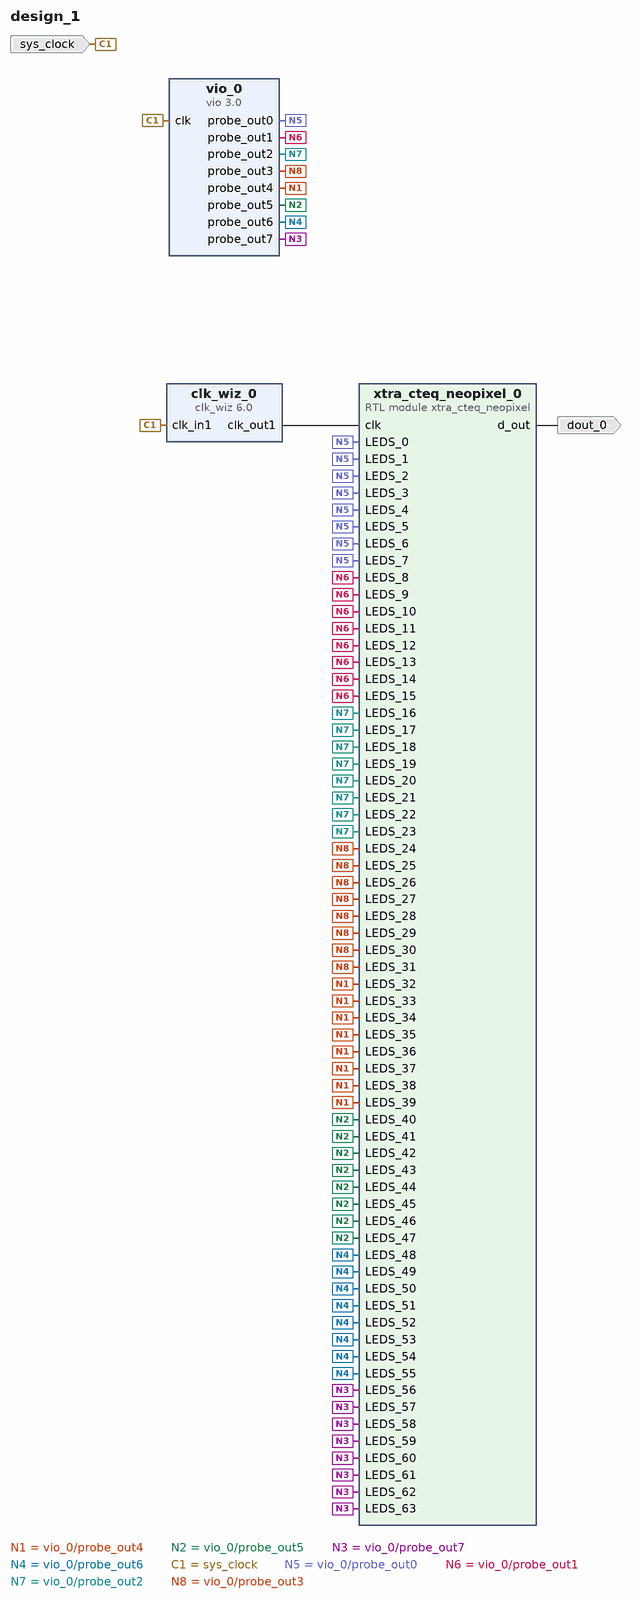
[diagram p0: block diagram of the top level]
# Vivado block design design_1, xc7z020clg400-1, Vivado 2021.2
create_bd_design design_1

create_bd_port -dir I -type clk sys_clock
set_property -dict {CONFIG.FREQ_HZ 125000000 CONFIG.PHASE 0.0} [get_bd_ports sys_clock]
create_bd_port -dir O dout_0

create_bd_cell -type ip -vlnv xilinx.com:ip:clk_wiz:6.0 clk_wiz_0
set_property -dict [list \
  CONFIG.CLKOUT1_JITTER 143.688 \
  CONFIG.CLKOUT1_PHASE_ERROR 96.948 \
  CONFIG.CLKOUT1_REQUESTED_OUT_FREQ 50 \
  CONFIG.CLKOUT1_USED true \
  CONFIG.CLK_IN1_BOARD_INTERFACE sys_clock \
  CONFIG.MMCM_CLKFBOUT_MULT_F 8.000 \
  CONFIG.MMCM_CLKOUT0_DIVIDE_F 20.000 \
  CONFIG.MMCM_DIVCLK_DIVIDE 1 \
  CONFIG.USE_BOARD_FLOW true \
  CONFIG.USE_LOCKED false \
  CONFIG.USE_RESET false \
] [get_bd_cells clk_wiz_0]
create_bd_cell -type module -reference xtra_cteq_neopixel xtra_cteq_neopixel_0
create_bd_cell -type ip -vlnv xilinx.com:ip:vio:3.0 vio_0
set_property -dict [list \
  CONFIG.C_NUM_PROBE_IN 0 \
  CONFIG.C_NUM_PROBE_OUT 8 \
  CONFIG.C_PROBE_OUT0_INIT_VAL 0x00FF00 \
  CONFIG.C_PROBE_OUT0_WIDTH 24 \
  CONFIG.C_PROBE_OUT1_INIT_VAL 0x00FF00 \
  CONFIG.C_PROBE_OUT1_WIDTH 24 \
  CONFIG.C_PROBE_OUT2_INIT_VAL 0x00FF00 \
  CONFIG.C_PROBE_OUT2_WIDTH 24 \
  CONFIG.C_PROBE_OUT3_INIT_VAL 0x0000FF \
  CONFIG.C_PROBE_OUT3_WIDTH 24 \
  CONFIG.C_PROBE_OUT4_INIT_VAL 0x0000FF \
  CONFIG.C_PROBE_OUT4_WIDTH 24 \
  CONFIG.C_PROBE_OUT5_INIT_VAL 0x0000FF \
  CONFIG.C_PROBE_OUT5_WIDTH 24 \
  CONFIG.C_PROBE_OUT6_INIT_VAL 0x0FF000 \
  CONFIG.C_PROBE_OUT6_WIDTH 24 \
  CONFIG.C_PROBE_OUT7_INIT_VAL 0x0FF000 \
  CONFIG.C_PROBE_OUT7_WIDTH 24 \
] [get_bd_cells vio_0]

# ---- connections ----

connect_bd_net [get_bd_pins vio_0/probe_out4] \
  [get_bd_pins xtra_cteq_neopixel_0/LEDS_32] [get_bd_pins xtra_cteq_neopixel_0/LEDS_33] \
  [get_bd_pins xtra_cteq_neopixel_0/LEDS_34] [get_bd_pins xtra_cteq_neopixel_0/LEDS_35] \
  [get_bd_pins xtra_cteq_neopixel_0/LEDS_36] [get_bd_pins xtra_cteq_neopixel_0/LEDS_37] \
  [get_bd_pins xtra_cteq_neopixel_0/LEDS_38] [get_bd_pins xtra_cteq_neopixel_0/LEDS_39]
connect_bd_net [get_bd_pins vio_0/probe_out5] \
  [get_bd_pins xtra_cteq_neopixel_0/LEDS_40] [get_bd_pins xtra_cteq_neopixel_0/LEDS_41] \
  [get_bd_pins xtra_cteq_neopixel_0/LEDS_42] [get_bd_pins xtra_cteq_neopixel_0/LEDS_43] \
  [get_bd_pins xtra_cteq_neopixel_0/LEDS_44] [get_bd_pins xtra_cteq_neopixel_0/LEDS_45] \
  [get_bd_pins xtra_cteq_neopixel_0/LEDS_46] [get_bd_pins xtra_cteq_neopixel_0/LEDS_47]
connect_bd_net [get_bd_pins vio_0/probe_out7] \
  [get_bd_pins xtra_cteq_neopixel_0/LEDS_63] [get_bd_pins xtra_cteq_neopixel_0/LEDS_62] \
  [get_bd_pins xtra_cteq_neopixel_0/LEDS_61] [get_bd_pins xtra_cteq_neopixel_0/LEDS_60] \
  [get_bd_pins xtra_cteq_neopixel_0/LEDS_59] [get_bd_pins xtra_cteq_neopixel_0/LEDS_58] \
  [get_bd_pins xtra_cteq_neopixel_0/LEDS_57] [get_bd_pins xtra_cteq_neopixel_0/LEDS_56]
connect_bd_net [get_bd_pins vio_0/probe_out6] \
  [get_bd_pins xtra_cteq_neopixel_0/LEDS_48] [get_bd_pins xtra_cteq_neopixel_0/LEDS_49] \
  [get_bd_pins xtra_cteq_neopixel_0/LEDS_50] [get_bd_pins xtra_cteq_neopixel_0/LEDS_51] \
  [get_bd_pins xtra_cteq_neopixel_0/LEDS_52] [get_bd_pins xtra_cteq_neopixel_0/LEDS_53] \
  [get_bd_pins xtra_cteq_neopixel_0/LEDS_54] [get_bd_pins xtra_cteq_neopixel_0/LEDS_55]
connect_bd_net [get_bd_pins clk_wiz_0/clk_out1] [get_bd_pins xtra_cteq_neopixel_0/clk]
connect_bd_net [get_bd_ports sys_clock] [get_bd_pins clk_wiz_0/clk_in1] [get_bd_pins vio_0/clk]
connect_bd_net [get_bd_pins vio_0/probe_out0] \
  [get_bd_pins xtra_cteq_neopixel_0/LEDS_0] [get_bd_pins xtra_cteq_neopixel_0/LEDS_1] \
  [get_bd_pins xtra_cteq_neopixel_0/LEDS_2] [get_bd_pins xtra_cteq_neopixel_0/LEDS_3] \
  [get_bd_pins xtra_cteq_neopixel_0/LEDS_4] [get_bd_pins xtra_cteq_neopixel_0/LEDS_5] \
  [get_bd_pins xtra_cteq_neopixel_0/LEDS_6] [get_bd_pins xtra_cteq_neopixel_0/LEDS_7]
connect_bd_net [get_bd_pins vio_0/probe_out1] \
  [get_bd_pins xtra_cteq_neopixel_0/LEDS_8] [get_bd_pins xtra_cteq_neopixel_0/LEDS_9] \
  [get_bd_pins xtra_cteq_neopixel_0/LEDS_10] [get_bd_pins xtra_cteq_neopixel_0/LEDS_11] \
  [get_bd_pins xtra_cteq_neopixel_0/LEDS_12] [get_bd_pins xtra_cteq_neopixel_0/LEDS_13] \
  [get_bd_pins xtra_cteq_neopixel_0/LEDS_14] [get_bd_pins xtra_cteq_neopixel_0/LEDS_15]
connect_bd_net [get_bd_pins vio_0/probe_out2] \
  [get_bd_pins xtra_cteq_neopixel_0/LEDS_16] [get_bd_pins xtra_cteq_neopixel_0/LEDS_17] \
  [get_bd_pins xtra_cteq_neopixel_0/LEDS_18] [get_bd_pins xtra_cteq_neopixel_0/LEDS_19] \
  [get_bd_pins xtra_cteq_neopixel_0/LEDS_20] [get_bd_pins xtra_cteq_neopixel_0/LEDS_21] \
  [get_bd_pins xtra_cteq_neopixel_0/LEDS_22] [get_bd_pins xtra_cteq_neopixel_0/LEDS_23]
connect_bd_net [get_bd_pins vio_0/probe_out3] \
  [get_bd_pins xtra_cteq_neopixel_0/LEDS_24] [get_bd_pins xtra_cteq_neopixel_0/LEDS_25] \
  [get_bd_pins xtra_cteq_neopixel_0/LEDS_26] [get_bd_pins xtra_cteq_neopixel_0/LEDS_27] \
  [get_bd_pins xtra_cteq_neopixel_0/LEDS_28] [get_bd_pins xtra_cteq_neopixel_0/LEDS_29] \
  [get_bd_pins xtra_cteq_neopixel_0/LEDS_30] [get_bd_pins xtra_cteq_neopixel_0/LEDS_31]
connect_bd_net [get_bd_pins xtra_cteq_neopixel_0/d_out] [get_bd_ports dout_0]

validate_bd_design
save_bd_design
